# Altium schematic sheet Raspberry.SchDoc
size A4
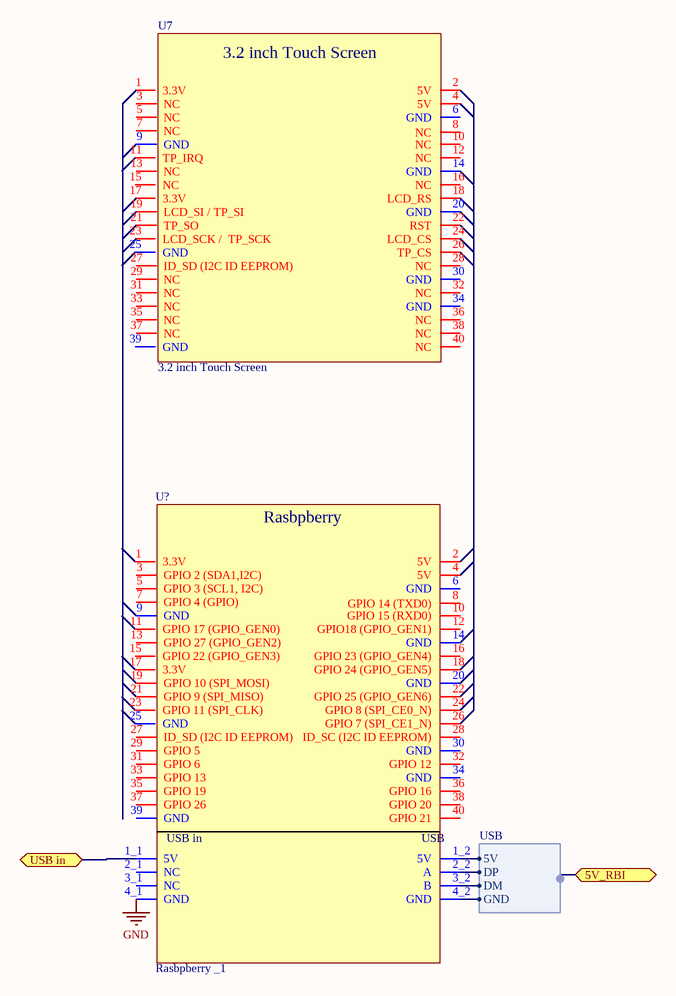
[diagram p0: Raspberry.SchDoc]

## Parts
U7  3.2 inch Touch Screen
U?  Rasbpberry _1

## Ports
5V_RBI, USB in

## Harnesses
USB: 5V, DP, DM, GND

## Nets
GND: U?.4_1(GND)
USB in: U?.1_1(5V) ; port USB in
NetU?_1_2: U?.1_2(5V) ; harness USB.5V
NetU?_2_2: U?.2_2(A) ; harness USB.DP
NetU?_3_2: U?.3_2(B) ; harness USB.DM
NetU?_4_2: U?.4_2(GND) ; harness USB.GND

Not connected (* = marked no-connect by the designer): U7 1(3.3V) 2(5V) 3(NC) 4(5V) 5(NC) 6(GND) 7(NC) 8(NC) 9(GND) 10(NC) 11(TP_IRQ) 12(NC) 13(NC) 14(GND) 15(NC) 16(NC) 17(3.3V) 18(LCD_RS) 19(LCD_SI_/_TP_SI) 20(GND) 21(TP_SO) 22(RST) 23(LCD_SCK_/__TP_SCK) 24(LCD_CS) 25(GND) 26(TP_CS) 27(ID_SD_(I2C_ID_EEPROM)) 28(NC) 29(NC) 30(GND) 31(NC) 32(NC) 33(NC) 34(GND) 35(NC) 36(NC) 37(NC) 38(NC) 39(GND) 40(NC); U? 1(3.3V) 2(5V) 2_1(NC) 3(GPIO_2_(SDA1,I2C)) 3_1(NC) 4(5V) 5(GPIO_3_(SCL1,_I2C)) 6(GND) 7(GPIO_4_(GPIO)) 8(GPIO_14_(TXD0)) 9(GND) 10(GPIO_15_(RXD0)) 11(GPIO_17_(GPIO_GEN0)) 12(GPIO18_(GPIO_GEN1)) 13(GPIO_27_(GPIO_GEN2)) 14(GND) 15(GPIO_22_(GPIO_GEN3)) 16(GPIO_23_(GPIO_GEN4)) 17(3.3V) 18(GPIO_24_(GPIO_GEN5)) 19(GPIO_10_(SPI_MOSI)) 20(GND) 21(GPIO_9_(SPI_MISO)) 22(GPIO_25_(GPIO_GEN6)) 23(GPIO_11_(SPI_CLK)) 24(GPIO_8_(SPI_CE0_N)) 25(GND) 26(GPIO_7_(SPI_CE1_N)) 27(ID_SD_(I2C_ID_EEPROM)) 28(ID_SC_(I2C_ID_EEPROM)) 29(GPIO_5) 30(GND) 31(GPIO_6) 32(GPIO_12) 33(GPIO_13) 34(GND) 35(GPIO_19) 36(GPIO_16) 37(GPIO_26) 38(GPIO_20) 39(GND) 40(GPIO_21)

## Notes on the sheet
- (in symbol Rasbpberry _1) Rasbpberry; USB in; USB